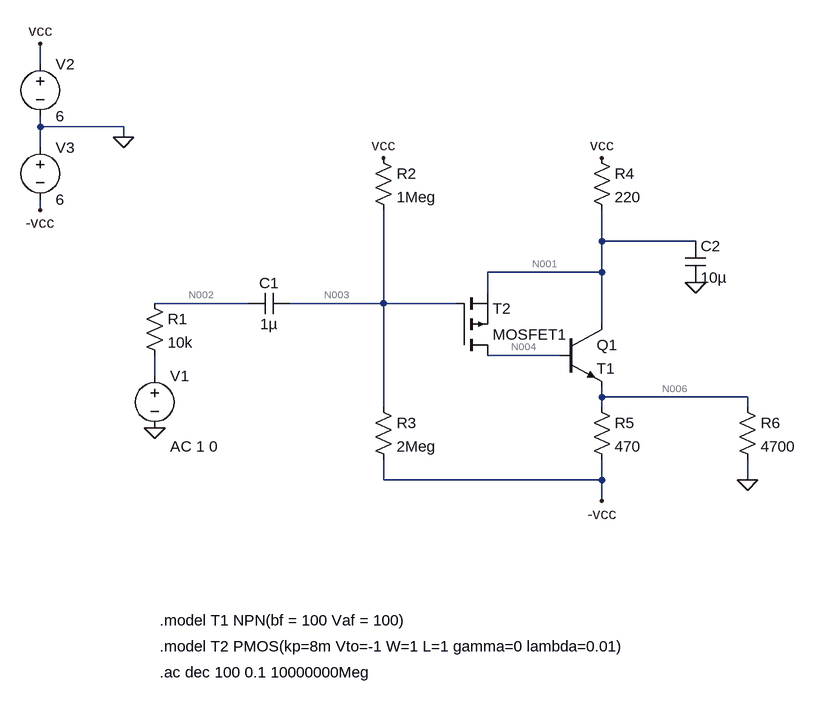
[diagram p0: schematic 041124respuestaenfrecuencia.asc]
041124respuestaenfrecuencia.asc, the LTspice schematic file:
Version 4
SHEET 1 980 680
WIRE -192 -336 -192 -368
WIRE -192 -240 -192 -256
WIRE -64 -240 -192 -240
WIRE -64 -224 -64 -240
WIRE -192 -208 -192 -240
WIRE -192 -112 -192 -128
WIRE 672 -64 672 -112
WIRE 816 -64 672 -64
WIRE 672 -16 672 -64
WIRE 672 -16 496 -16
WIRE 496 16 496 -16
WIRE 128 32 -16 32
WIRE 336 32 336 -112
WIRE 336 32 192 32
WIRE 448 32 336 32
WIRE 672 64 672 -16
WIRE 608 112 496 112
WIRE -16 144 -16 112
WIRE 672 176 672 160
WIRE 896 176 672 176
WIRE 336 192 336 32
WIRE 672 192 672 176
WIRE 896 192 896 176
WIRE 336 304 336 272
WIRE 672 304 672 272
WIRE 672 304 336 304
WIRE 896 304 896 272
WIRE 672 336 672 304
FLAG -16 224 0
FLAG -64 -224 0
FLAG -192 -368 vcc
FLAG -192 -112 -vcc
FLAG 336 -192 vcc
FLAG 672 -192 vcc
FLAG 672 336 -vcc
FLAG 896 304 0
FLAG 816 0 0
SYMBOL voltage -16 128 R0
WINDOW 123 24 124 Left 2
WINDOW 39 0 0 Left 0
SYMATTR InstName V1
SYMATTR Value ""
SYMATTR Value2 AC 1 0
SYMBOL res -32 16 R0
SYMATTR InstName R1
SYMATTR Value 10k
SYMBOL cap 192 16 R90
WINDOW 0 0 32 VBottom 2
WINDOW 3 32 32 VTop 2
SYMATTR InstName C1
SYMATTR Value 1µ
SYMBOL res 656 -208 R0
SYMATTR InstName R4
SYMATTR Value 220
SYMBOL res 320 -208 R0
SYMATTR InstName R2
SYMATTR Value 1Meg
SYMBOL res 320 176 R0
SYMATTR InstName R3
SYMATTR Value 2Meg
SYMBOL pmos 448 112 M180
SYMATTR InstName MOSFET1
SYMATTR Value T2
SYMBOL npn 608 64 R0
SYMATTR InstName Q1
SYMATTR Value T1
SYMBOL voltage -192 -352 R0
SYMATTR InstName V2
SYMATTR Value 6
SYMBOL voltage -192 -224 R0
SYMATTR InstName V3
SYMATTR Value 6
SYMBOL res 656 176 R0
SYMATTR InstName R5
SYMATTR Value 470
SYMBOL cap 800 -64 R0
SYMATTR InstName C2
SYMATTR Value 10µ
SYMBOL res 880 176 R0
SYMATTR InstName R6
SYMATTR Value 4700
TEXT -8 520 Left 2 !.model T1 NPN(bf = 100 Vaf = 100)
TEXT -8 560 Left 2 !.model T2 PMOS(kp=8m Vto=-1 W=1 L=1 gamma=0 lambda=0.01)
TEXT -8 600 Left 2 !.ac dec 100 0.1 10000000Meg

The netlist it stands for:
* 041124respuestaenfrecuencia.asc
V1 N005 0 AC 1 0
R1 N002 N005 10k
C1 N003 N002 1µ
R4 vcc N001 220
R2 vcc N003 1Meg
R3 N003 -vcc 2Meg
MOSFET1 N004 N003 N001 N001 T2
Q1 N001 N004 N006 0 T1
V2 vcc 0 6
V3 0 -vcc 6
R5 N006 -vcc 470
C2 N001 0 10µ
R6 N006 0 4700
.model NPN NPN
.model PNP PNP
.lib standard.bjt
.model NMOS NMOS
.model PMOS PMOS
.lib standard.mos
.model T1 NPN(bf = 100 Vaf = 100)
.model T2 PMOS(kp=8m Vto=-1 W=1 L=1 gamma=0 lambda=0.01)
.ac dec 100 0.1 10000000Meg
.backanno
.end

* Results of the author's LTspice run, read from the files saved beside the schematic
* Operating Point, zero values left out:
*   V(n003) = 2 V
*   V(vcc) = 6 V
*   V(n001) = 3.174 V
*   V(-vcc) = -6 V
*   V(n004) = 872.8 mV
*   V(n006) = 33.36 mV
*   Ic(Q1) = 12.72 mA
*   Ib(Q1) = 124.3 µA
*   Ie(Q1) = -12.84 mA
*   Id(Mosfet1) = -124.3 µA
*   Ib(Mosfet1) = 2.312 pA
*   Is(Mosfet1) = 124.3 µA
*   I(R4) = 12.84 mA
*   I(R2) = 4 µA
*   I(R3) = 4 µA
*   I(R5) = 12.84 mA
*   I(R6) = 7.098 µA
*   I(V2) = -12.85 mA
*   I(V3) = -12.84 mA
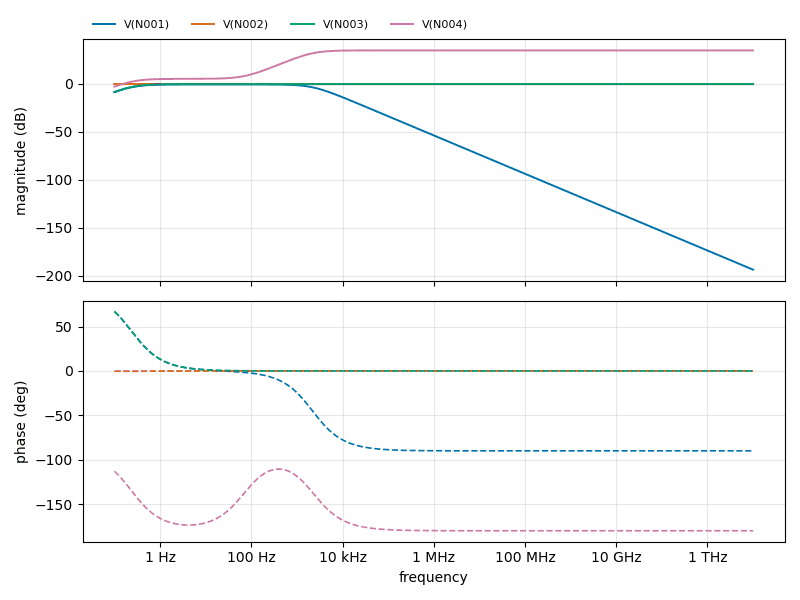
[diagram p1: AC Analysis of 041124respuestaenfrecuencia.asc, plotted from the saved traces]
* AC Analysis, 1 run:
*   V(N001): -8.59 dB at 100 mHz, -193.61 dB at 10 THz, peak -0.44 dB at 22.91 Hz, 3 dB below the peak at 235.2 mHz and 2.195 kHz
*   V(N002): -0.02 dB at 100 mHz, -0.13 dB at 10 THz, peak -0.02 dB at 100 mHz
*   V(N003): -8.28 dB at 100 mHz, -0.13 dB at 10 THz, peak -0.13 dB at 66.07 MHz, 3 dB below the peak at 235.2 mHz
*   V(N004): -2.78 dB at 100 mHz, 35.01 dB at 10 THz, peak 35.01 dB at 263 GHz, 3 dB below the peak at 2.192 kHz